# EAGLE design PCB-CARR-ENCODER (EAGLE 7.5.0)
SKAARHOJ 2012 Rotary Encoder Breakout Board
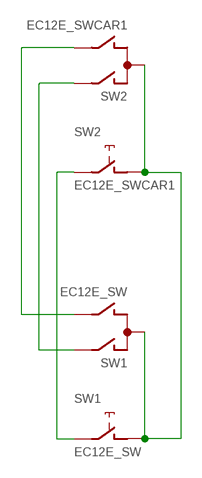
[diagram p0: schematic, sheet 1]

## Parts
SW1  EC12E_SW  [ALPS_EC12E_SW]
SW2  EC12E_SWCAR1  [ALPS_EC12E_SW-CAR1]

## Nets
N$1 [Power]: SW1.C SW1.D SW2.C SW2.D
N$2: SW1.E SW2.E
N$4: SW1.A SW2.A
N$5: SW1.B SW2.B
Unconnected: SW1.GND1(G) SW1.GND2(G) SW2.GND1(G) SW2.GND2(G)

## Library data of the parts
SW1 = switch-alps:EC12E_SW: ALPS rotary Encoder EC12E series with switch; MPN: EC12E2424407; OC_FARNELL: 1520813; OC_NEWARK: 74M1068
SW2 = SKAARHOJ:EC12E_SW: ALPS rotary Encoder EC12E series with switch

## Net classes
0 default: width 0.203 mm, drill 0.406 mm, clearance 0.203 mm
1 Power: width 0.254 mm, drill 0.406 mm, clearance 0.254 mm

## Board
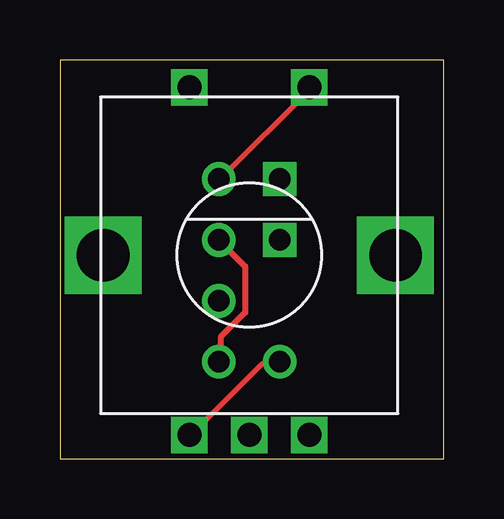
[diagram p1: board, top side]
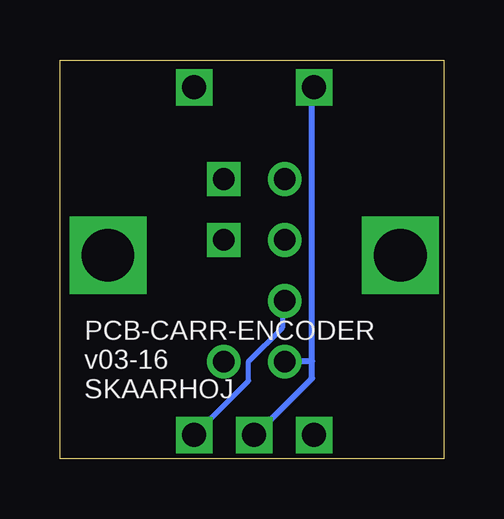
[diagram p2: board, bottom side, seen from below]

Size 16 x 16.63 mm. Coordinates in mm from the lower left corner, seen from the top.
Outline: 0,0 16,0 16,16.63 0,16.63 0,0
Copper layers (1*16): Top 0.035mm / dielectric 1.5mm / Bottom 0.035mm
Design rules "Fusion_eagle_rule_v1.1": minimum track width 6mil, minimum drill 12mil, track to track 6mil, track to pad 6mil, pad to pad 6mil, via to via 6mil, smd to smd 0mil, copper to edge 10mil, drill to drill 10mil, minimum pad ring 10mil, minimum via ring 6mil, stop-mask expansion 2mil, vias tented up to drill 100mil, thermal gap 10mil

### Footprints (pad centres in the part's own frame; a part is rotated, then mirrored left to right if it is on the bottom)
ALPS_EC12E_SW = drill 1 square: A -2.5,-7.5; B 2.5,-7.5; C 0,-7.5; D -2.5,7; E 2.5,7 | drill 2.2 square: GND1 -6.1,0; GND2 6.1,0
ALPS_EC12E_SW-CAR1 = drill 0.9: A 1.27,-4.445; B -1.27,-1.905; C -1.27,-4.445; D -1.27,0.635; E -1.27,3.175 | drill 0.9 square: GND1 1.27,3.175; GND2 1.27,0.635

### Placement (x,y rotation side)
SW1  7.9,8.49 0 top
SW2  7.9,8.49 0 top

### Tracks (layer width: path | path; a pad name or v marks a point on that pad's centre or on a via)
N$1
  Top 0.254: SW2.C 6.71,4.06 6.71,5.08 7.72,6.1 7.72,8.03 6.71,9.04 SW2.D
  Bottom 0.254: 5.49,4.06 5.49,3.35 7.82,1.02 SW1.C | 5.49,4.06 5.49,15.44 SW1.D | 5.49,4.06 6.6,4.06 SW2.C
N$2
  Top 0.203: SW2.E 6.71,11.68 10.46,15.44 SW1.E
N$4
  Top 0.203: SW2.A 9.14,3.96 8.43,3.96 5.49,1.02 SW1.A
N$5
  Bottom 0.203: SW2.B 6.71,6.5 6.71,5.49 8.13,4.06 8.13,3.25 10.36,1.02 SW1.B

### Text on the board
_bsilk: PCB-CARR-ENCODER / v03-16 / SKAARHOJ